# Altium schematic sheet Sensor shoot2.SchDoc
size A
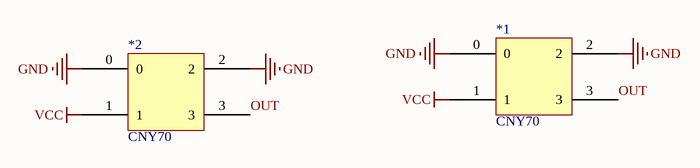
[diagram p0: Sensor shoot2.SchDoc]

## Parts
*1  CNY70  [CNY70]
*2  CNY70  [CNY70]

## Nets
GND: *1.0 *1.2 *2.0 *2.2
VCC: *1.1 *2.1
OUT: *1.3 *2.3